# Altium project Dawn.PrjPcb
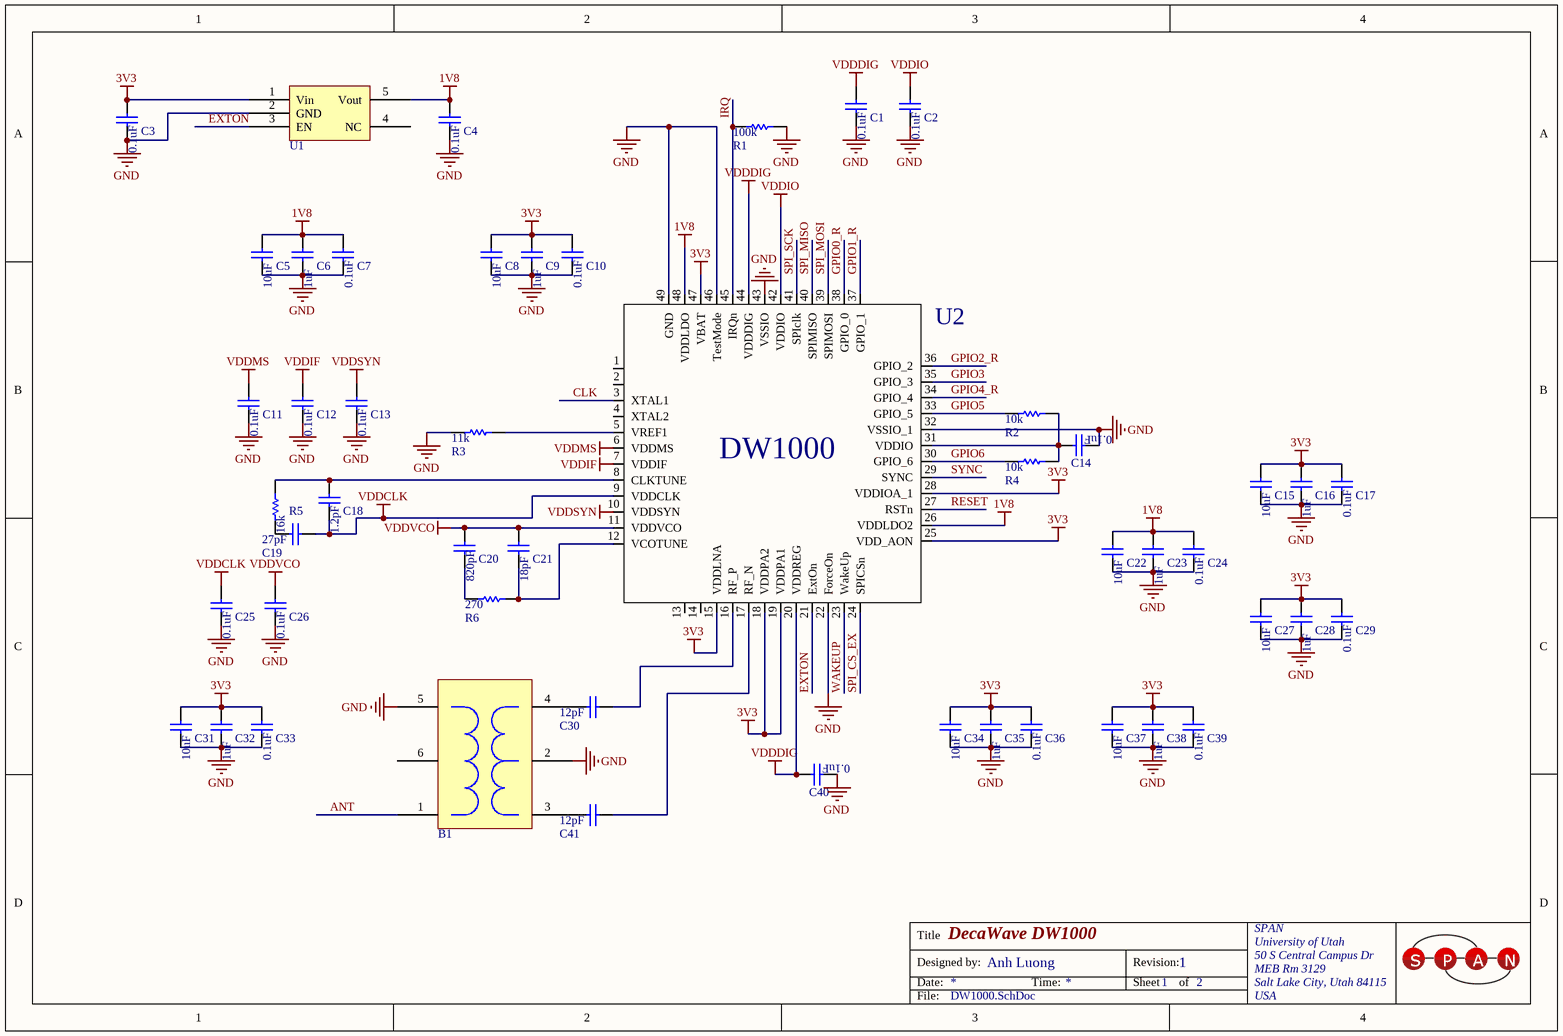
[diagram p0: DW1000.SchDoc]
3 sheets, 91 parts. Net scope: global (net labels, ports and power ports of the same name join across sheets).
Board file: Dawn.PcbDoc
Sheets:
  DW1000.SchDoc
  Dawn.SchDoc
  HFXO.SchDoc

## Sheet DW1000.SchDoc: DecaWave DW1000
size A4; CompanyName: SPAN; Engineer: Anh Luong; Organization: University of Utah; Address1: 50 S Central Campus Dr; Address2: MEB Rm 3129; Address3: Salt Lake City, Utah 84115; Address4: USA; Revision: 1; SheetNumber: 1; SheetTotal: 2

### Parts
B1  HHM1595A1  [BALUN]  (value not drawn)
C1  GRM188R71C104KA01D  [CAPC1608X08N (0603)]  (value not drawn)
C2  GRM188R71C104KA01D  [CAPC1608X08N (0603)]  (value not drawn)
C3  GRM188R71C104KA01D  [CAPC1608X08N (0603)]  (value not drawn)
C4  GRM188R71C104KA01D  [CAPC1608X08N (0603)]  (value not drawn)
C5  GRM188R60J106ME47D  [CAPC1608X08N (0603)]  (value not drawn)
C6  GRM188R61A105KA61D  [CAPC1608X08N (0603)]  (value not drawn)
C7  GRM188R71C104KA01D  [CAPC1608X08N (0603)]  (value not drawn)
C8  GRM188R60J106ME47D  [CAPC1608X08N (0603)]  (value not drawn)
C9  GRM188R61A105KA61D  [CAPC1608X08N (0603)]  (value not drawn)
C10  GRM188R71C104KA01D  [CAPC1608X08N (0603)]  (value not drawn)
C11  GRM188R71C104KA01D  [CAPC1608X08N (0603)]  (value not drawn)
C12  GRM188R71C104KA01D  [CAPC1608X08N (0603)]  (value not drawn)
C13  GRM188R71C104KA01D  [CAPC1608X08N (0603)]  (value not drawn)
C14  GRM188R71C104KA01D  [CAPC1608X08N (0603)]  (value not drawn)
C15  GRM188R60J106ME47D  [CAPC1608X08N (0603)]  (value not drawn)
C16  GRM188R61A105KA61D  [CAPC1608X08N (0603)]  (value not drawn)
C17  GRM188R71C104KA01D  [CAPC1608X08N (0603)]  (value not drawn)
C18  GRM1885C1H1R2CA01D  [CAPC1608X08N (0603)]  (value not drawn)
C19  GRM1885C1H270JA01D  [CAPC1608X08N (0603)]  (value not drawn)
C20  GRM188R71H821KA01D  [CAPC1608X08N (0603)]  (value not drawn)
C21  GRM1885C1H180JA01D  [CAPC1608X08N (0603)]  (value not drawn)
C22  GRM188R60J106ME47D  [CAPC1608X08N (0603)]  (value not drawn)
C23  GRM188R61A105KA61D  [CAPC1608X08N (0603)]  (value not drawn)
C24  GRM188R71C104KA01D  [CAPC1608X08N (0603)]  (value not drawn)
C25  GRM188R71C104KA01D  [CAPC1608X08N (0603)]  (value not drawn)
C26  GRM188R71C104KA01D  [CAPC1608X08N (0603)]  (value not drawn)
C27  GRM188R60J106ME47D  [CAPC1608X08N (0603)]  (value not drawn)
C28  GRM188R61A105KA61D  [CAPC1608X08N (0603)]  (value not drawn)
C29  GRM188R71C104KA01D  [CAPC1608X08N (0603)]  (value not drawn)
C30  GRM1885C1H120JA01D  [CAPC1608X08N (0603)]  (value not drawn)
C31  GRM188R60J106ME47D  [CAPC1608X08N (0603)]  (value not drawn)
C32  GRM188R61A105KA61D  [CAPC1608X08N (0603)]  (value not drawn)
C33  GRM188R71C104KA01D  [CAPC1608X08N (0603)]  (value not drawn)
C34  GRM188R60J106ME47D  [CAPC1608X08N (0603)]  (value not drawn)
C35  GRM188R61A105KA61D  [CAPC1608X08N (0603)]  (value not drawn)
C36  GRM188R71C104KA01D  [CAPC1608X08N (0603)]  (value not drawn)
C37  GRM188R60J106ME47D  [CAPC1608X08N (0603)]  (value not drawn)
C38  GRM188R61A105KA61D  [CAPC1608X08N (0603)]  (value not drawn)
C39  GRM188R71C104KA01D  [CAPC1608X08N (0603)]  (value not drawn)
C40  GRM188R71C104KA01D  [CAPC1608X08N (0603)]  (value not drawn)
C41  GRM1885C1H120JA01D  [CAPC1608X08N (0603)]  (value not drawn)
R1  MCR03ERTJ104  [RESC1608X06N (0603)]  (value not drawn)
R2  MCR03ERTJ103  [RESC1608X06N (0603)]  (value not drawn)
R3  MCR03ERTJ113  [RESC1608X06N (0603)]  (value not drawn)
R4  MCR03ERTJ103  [RESC1608X06N (0603)]  (value not drawn)
R5  MCR03ERTJ163  [RESC1608X06N (0603)]  (value not drawn)
R6  MCR03ERTJ271  [RESC1608X06N (0603)]  (value not drawn)
U1  LP5907MFX-1.8/NOPB  [SOT95P280X145-5N]  (value not drawn)
U2  DW1000 IC  [QFN-48]  (value not drawn)

### Nets
1V8: C4.2 C5.2 C6.2 C7.2 C22.2 C23.2 C24.2 U1.5(Vout) U2.26(VDDLDO2) U2.48(VDDLDO)
3V3: C3.2 C8.2 C9.2 C10.2 C15.2 C16.2 C17.2 C27.2 C28.2 C29.2 C31.2 C32.2 C33.2 C34.2 C35.2 C36.2 C37.2 C38.2 C39.2 U1.1(Vin) U2.15(VDDLNA) U2.18(VDDPA2) U2.19(VDDPA1) U2.25(VDD_AON) U2.28(VDDIOA_1) U2.47(VBAT)
GND: B1.2 B1.5 C1.1 C2.1 C3.1 C4.1 C5.1 C6.1 C7.1 C8.1 C9.1 C10.1 C11.1 C12.1 C13.1 C14.1 C15.1 C16.1 C17.1 C22.1 C23.1 C24.1 C25.1 C26.1 C27.1 C28.1 C29.1 C31.1 C32.1 C33.1 C34.1 C35.1 C36.1 C37.1 C38.1 C39.1 C40.1 R1.2 R3.1 U1.2(GND) U2.22(ForceOn) U2.32(VSSIO_1) U2.43(VSSIO) U2.46(TestMode) U2.49(GND)
VDDCLK: C18.1 C19.2 C25.2 U2.9(VDDCLK)
VDDDIG: C1.2 C40.2 U2.20(VDDREG) U2.44(VDDDIG)
VDDIF: C12.2 U2.7(VDDIF)
VDDIO: C2.2 U2.42(VDDIO)
VDDMS: C11.2 U2.6(VDDMS)
VDDSYN: C13.2 U2.10(VDDSYN)
VDDVCO: C20.2 C21.2 C26.2 U2.11(VDDVCO)
ANT: B1.1
CLK: U2.3(XTAL1)
EXTON: U1.3(EN) U2.21(ExtOn)
GPIO0_R: U2.38(GPIO_0)
GPIO1_R: U2.37(GPIO_1)
GPIO2_R: U2.36(GPIO_2)
GPIO3: U2.35(GPIO_3)
GPIO4_R: U2.34(GPIO_4)
GPIO5: R2.1 U2.33(GPIO_5)
GPIO6: R4.1 U2.30(GPIO_6)
IRQ: R1.1 U2.45(IRQn)
RESET: U2.27(RSTn)
SPI_CS_EX: U2.24(SPICSn)
SPI_MISO: U2.40(SPIMISO)
SPI_MOSI: U2.39(SPIMOSI)  [project net SDI]
SPI_SCK: U2.41(SPIclk)  [project net SCLK]
SYNC: U2.29(SYNC)
WAKEUP: U2.23(WakeUp)
NetB1_3: B1.3 C41.1
NetB1_4: B1.4 C30.1
NetC14_2: C14.2 R2.2 R4.2 U2.31(VDDIO)
NetC18_2: C18.2 R5.2 U2.8(CLKTUNE)
NetC19_1: C19.1 R5.1
NetC20_1: C20.1 R6.1
NetC21_1: C21.1 R6.2 U2.12(VCOTUNE)
NetC30_2: C30.2 U2.16(RF_P)
NetC41_2: C41.2 U2.17(RF_N)
NetR3_2: R3.2 U2.5(VREF1)

Not connected (* = marked no-connect by the designer): B1 6; U1 4(NC); U2 1 2 4(XTAL2) 13 14

### Notes on the sheet
- Title
- Designed by:
- Date:
- Time:
- Revision:
- Sheet
- of
- File:
- (in symbol DW1000_QFN_48) DW1000
- (in symbol GRM188R60J106ME47D) 10uF
- (in symbol GRM188R61A105KA61D) 1uF
- (in symbol GRM188R71C104KA01D) 0.1uF

### Library data of the parts
B1 = HHM1595A1: XFMR BALUN RF 3.0-8.0GHZ UWB SMD; Manufacturer: TDK Corporation; Frequency Range: 3GHz ~ 8GHz; Impedance - Unbalanced/Balanced: 50 / 100 Ohm; Phase Difference: 180° ±20; Insertion Loss (Max): 1.5dB; Return Loss (Min): 8dB; Supplier 1: Digi-Key; Manufacturer Part Number: HHM1595A1; RoHS: RoHS Compliant; Category: RF/IF and RFID; Stock 1: 20610; Pricing 1: 1=1.38, 10=1.348, 100=0.7356, 250=0.66, 500=0.64626, 1000=0.4675 (USD); Packaging: Cut Tape (CT); Part Status: Active; Package / Case: 0805 (2012 Metric); Mounting Type: Surface Mount; ComponentLink1URL: https://product.tdk.com/info/en/documents/data_sheet/rf_balun_hhm1595a1_en.pdf; ComponentLink1Description: https://product.tdk.com/info/en/documents/data_sheet/rf_balun_hhm1595a1_en.pdf; Supplier Part Number 1: 445-3387-1-ND
C1-C4 C7 C10-C14 C17 C24-C26 C29 C33 C36 C39 C40 = GRM188R71C104KA01D: CAP CER 0.1UF 16V 10% X7R 0603; Manufacturer: Murata Electronics North America; Capacitance: 0.1µF; Supplier 1: Digi-Key; Manufacturer Part Number: GRM188R71C104KA01D; RoHS: RoHS Compliant; Category: Capacitors; Stock 1: 1458181; Pricing 1: 1=0.1, 10=0.019, 50=0.0102, 100=0.0086, 250=0.00704, 500=0.006, 1000=0.00468 (USD); Packaging: Cut Tape (CT); Tolerance: ±10%; Voltage - Rated: 16V; Temperature Coefficient: X7R; Mounting Type: Surface Mount, MLCC; Operating Temperature: -55°C ~ 125°C; Applications: General Purpose; Ratings: -; Package / Case: 0603 (1608 Metric); Size / Dimension: 0.063" L x 0.031" W (1.60mm x 0.80mm); Height - Seated (Max): -; Thickness (Max): 0.035" (0.90mm); Lead Spacing: -; Features: -; Lead Style: -; ComponentLink1URL: http://search.murata.co.jp/Ceramy/image/img/A01X/G101/ENG/GRM188R71C104KA01-01.pdf; ComponentLink1Description: http://search.murata.co.jp/Ceramy/image/img/A01X/G101/ENG/GRM188R71C104KA01-01.pdf
C5 C8 C15 C22 C27 C31 C34 C37 = GRM188R60J106ME47D: CAP CER 10UF 6.3V 20% X5R 0603; Manufacturer: Murata Electronics North America; Capacitance: 10µF; Supplier 1: Digi-Key; Manufacturer Part Number: GRM188R60J106ME47D; RoHS: RoHS Compliant; Category: Capacitors; Stock 1: 2128324; Pricing 1: 1=0.24, 10=0.2, 50=0.1126, 100=0.1, 250=0.075, 500=0.06626, 1000=0.05875 (USD); Packaging: Digi-Reel®; Voltage - Rated: 6.3V; Tolerance: ±20%; Temperature Coefficient: X5R; Mounting Type: Surface Mount, MLCC; Operating Temperature: -55°C ~ 85°C; Applications: General Purpose; Ratings: -; Package / Case: 0603 (1608 Metric); Size / Dimension: 0.063" L x 0.031" W (1.60mm x 0.80mm); Height - Seated (Max): -; Thickness (Max): 0.035" (0.90mm); Lead Spacing: -; Features: -; Lead Style: -; ComponentLink1URL: http://search.murata.co.jp/Ceramy/image/img/A01X/G101/ENG/GRM188R60J106ME47-01.pdf; ComponentLink1Description: http://search.murata.co.jp/Ceramy/image/img/A01X/G101/ENG/GRM188R60J106ME47-01.pdf; Supplier 2: Digi-Key
C6 C9 C16 C23 C28 C32 C35 C38 = GRM188R61A105KA61D: CAP CER 1UF 10V 10% X5R 0603; Manufacturer: Murata Electronics North America; Capacitance: 1.0µF; Supplier 1: Digi-Key; Manufacturer Part Number: GRM188R61A105KA61D; RoHS: RoHS Compliant; Category: Capacitors; Stock 1: 244919; Pricing 1: 1=0.1, 10=0.041, 50=0.0224, 100=0.019, 250=0.01552, 500=0.01328, 1000=0.01035 (USD); Packaging: Cut Tape (CT); Voltage - Rated: 10V; Tolerance: ±10%; Temperature Coefficient: X5R; Mounting Type: Surface Mount, MLCC; Operating Temperature: -55°C ~ 85°C; Applications: General Purpose; Ratings: -; Package / Case: 0603 (1608 Metric); Size / Dimension: 0.063" L x 0.031" W (1.60mm x 0.80mm); Height - Seated (Max): -; Thickness (Max): 0.035" (0.90mm); Lead Spacing: -; Features: -; Lead Style: -; ComponentLink1URL: http://search.murata.co.jp/Ceramy/image/img/A01X/G101/ENG/GRM188R61A105KA61-01.pdf; ComponentLink1Description: http://search.murata.co.jp/Ceramy/image/img/A01X/G101/ENG/GRM188R61A105KA61-01.pdf
C18 = GRM1885C1H1R2CA01D: CAP CER 1.2PF 50V NP0 0603; Manufacturer: Murata Electronics North America; Tolerance: ±0.25pF; Temperature Coefficient: C0G, NP0; Supplier 1: Digi-Key; Manufacturer Part Number: GRM1885C1H1R2CA01D; RoHS: RoHS Compliant; Category: Capacitors; Stock 1: 36680; Pricing 1: 1=0.1, 10=0.053, 50=0.0286, 100=0.0242, 250=0.0198, 500=0.01694, 1000=0.0132 (USD); Packaging: Cut Tape (CT); Part Status: Active; Capacitance: 1.2pF; Voltage - Rated: 50V; Operating Temperature: -55°C ~ 125°C; Features: -; Ratings: -; Applications: General Purpose; Failure Rate: *; Mounting Type: Surface Mount, MLCC; Package / Case: 0603 (1608 Metric); Size / Dimension: 0.063" L x 0.031" W (1.60mm x 0.80mm); Height - Seated (Max): -; Thickness (Max): 0.035" (0.90mm); Lead Spacing: -; Lead Style: -; ComponentLink1URL: http://www.murata.com/~/media/webrenewal/support/library/catalog/products/capacitor/mlcc/c02e.pdf; ComponentLink1Description: http://www.murata.com/~/media/webrenewal/support/library/catalog/products/capacitor/mlcc/c02e.pdf; Supplier Part Number 1: 490-10709-1-ND
C19 = GRM1885C1H270JA01D: CAP CER 27PF 50V NP0 0603; Manufacturer: Murata Electronics North America; Tolerance: ±5%; Temperature Coefficient: C0G, NP0; Supplier 1: Digi-Key; Manufacturer Part Number: GRM1885C1H270JA01D; RoHS: RoHS Compliant; Category: Capacitors; Stock 1: 113117; Pricing 1: 1=0.1, 10=0.041, 50=0.0222, 100=0.0187, 250=0.01532, 500=0.0131, 1000=0.0102 (USD); Packaging: Cut Tape (CT); Part Status: Active; Capacitance: 27pF; Voltage - Rated: 50V; Operating Temperature: -55°C ~ 125°C; Features: -; Ratings: -; Applications: General Purpose; Failure Rate: *; Mounting Type: Surface Mount, MLCC; Package / Case: 0603 (1608 Metric); Size / Dimension: 0.063" L x 0.031" W (1.60mm x 0.80mm); Height - Seated (Max): -; Thickness (Max): 0.035" (0.90mm); Lead Spacing: -; Lead Style: -; ComponentLink1URL: http://www.murata.com/~/media/webrenewal/support/library/catalog/products/capacitor/mlcc/c02e.pdf; ComponentLink1Description: http://www.murata.com/~/media/webrenewal/support/library/catalog/products/capacitor/mlcc/c02e.pdf; Supplier Part Number 1: 490-1413-1-ND
C20 = GRM188R71H821KA01D: CAP CER 820PF 50V X7R 0603; Manufacturer: Murata Electronics North America; Tolerance: ±10%; Supplier 1: Digi-Key; Manufacturer Part Number: GRM188R71H821KA01D; RoHS: RoHS Compliant; Category: Capacitors; Stock 1: 61936; Pricing 1: 1=0.1, 10=0.067, 25=0.0476, 50=0.0364, 100=0.0308, 250=0.0252, 500=0.02156, 1000=0.0168 (USD); Packaging: Cut Tape (CT); Part Status: Active; Capacitance: 820pF; Voltage - Rated: 50V; Temperature Coefficient: X7R; Operating Temperature: -55°C ~ 125°C; Features: -; Ratings: -; Applications: General Purpose; Failure Rate: *; Mounting Type: Surface Mount, MLCC; Package / Case: 0603 (1608 Metric); Size / Dimension: 0.063" L x 0.031" W (1.60mm x 0.80mm); Height - Seated (Max): -; Thickness (Max): 0.035" (0.90mm); Lead Spacing: -; Lead Style: -; ComponentLink1URL: http://www.murata.com/~/media/webrenewal/support/library/catalog/products/capacitor/mlcc/c02e.pdf; ComponentLink1Description: http://www.murata.com/~/media/webrenewal/support/library/catalog/products/capacitor/mlcc/c02e.pdf; Supplier Part Number 1: 490-1493-1-ND
C21 = GRM1885C1H180JA01D: CAP CER 18PF 50V NP0 0603; Manufacturer: Murata Electronics North America; Tolerance: ±5%; Temperature Coefficient: C0G, NP0; Supplier 1: Digi-Key; Manufacturer Part Number: GRM1885C1H180JA01D; RoHS: RoHS Compliant; Category: Capacitors; Stock 1: 281577; Pricing 1: 1=0.1, 10=0.041, 50=0.0222, 100=0.0187, 250=0.01532, 500=0.0131, 1000=0.0102 (USD); Packaging: Cut Tape (CT); Part Status: Active; Capacitance: 18pF; Voltage - Rated: 50V; Operating Temperature: -55°C ~ 125°C; Features: -; Ratings: -; Applications: General Purpose; Failure Rate: *; Mounting Type: Surface Mount, MLCC; Package / Case: 0603 (1608 Metric); Size / Dimension: 0.063" L x 0.031" W (1.60mm x 0.80mm); Height - Seated (Max): -; Thickness (Max): 0.035" (0.90mm); Lead Spacing: -; Lead Style: -; ComponentLink1URL: http://www.murata.com/~/media/webrenewal/support/library/catalog/products/capacitor/mlcc/c02e.pdf; ComponentLink1Description: http://www.murata.com/~/media/webrenewal/support/library/catalog/products/capacitor/mlcc/c02e.pdf; Supplier Part Number 1: 490-1409-1-ND
C30 C41 = GRM1885C1H120JA01D: CAP CER 12PF 50V NP0 0603; Manufacturer: Murata Electronics North America; Tolerance: ±5%; Temperature Coefficient: C0G, NP0; Supplier 1: Digi-Key; Manufacturer Part Number: GRM1885C1H120JA01D; RoHS: RoHS Compliant; Category: Capacitors; Stock 1: 151484; Pricing 1: 1=0.1, 10=0.041, 50=0.0222, 100=0.0187, 250=0.01532, 500=0.0131, 1000=0.0102 (USD); Packaging: Cut Tape (CT); Part Status: Active; Capacitance: 12pF; Voltage - Rated: 50V; Operating Temperature: -55°C ~ 125°C; Features: -; Ratings: -; Applications: General Purpose; Failure Rate: *; Mounting Type: Surface Mount, MLCC; Package / Case: 0603 (1608 Metric); Size / Dimension: 0.063" L x 0.031" W (1.60mm x 0.80mm); Height - Seated (Max): -; Thickness (Max): 0.035" (0.90mm); Lead Spacing: -; Lead Style: -; ComponentLink1URL: http://www.murata.com/~/media/webrenewal/support/library/catalog/products/capacitor/mlcc/c02e.pdf; ComponentLink1Description: http://www.murata.com/~/media/webrenewal/support/library/catalog/products/capacitor/mlcc/c02e.pdf; Supplier Part Number 1: 490-1405-1-ND
R1 = MCR03ERTJ104: RES SMD 100K OHM 5% 1/10W 0603; Manufacturer: Rohm Semiconductor; Power (Watts): 0.1W, 1/10W; Temperature Coefficient: ±200ppm/°C; Supplier 1: Digi-Key; Manufacturer Part Number: MCR03ERTJ104; RoHS: RoHS Compliant; Category: Resistors; Stock 1: 136580; Pricing 1: 1=0.1, 10=0.019, 25=0.0132, 100=0.0075, 250=0.00576, 500=0.0046, 1000=0.00338 (USD); Packaging: Cut Tape (CT); Part Status: Active; Resistance (Ohms): 100k; Tolerance: ±5%; Composition: Thick Film; Features: -; Operating Temperature: -55°C ~ 155°C; Package / Case: 0603 (1608 Metric); Supplier Device Package: 0603; Size / Dimension: 0.063" L x 0.031" W (1.60mm x 0.80mm); Height: 0.022" (0.55mm); Number of Terminations: 2; Failure Rate: -; ComponentLink1URL: http://rohmfs.rohm.com/en/products/databook/datasheet/passive/resistor/chip_resistor/mcr_g.pdf; ComponentLink1Description: http://rohmfs.rohm.com/en/products/databook/datasheet/passive/resistor/chip_resistor/mcr_g.pdf; Supplier Part Number 1: RHM100KCGCT-ND
R2 R4 = MCR03ERTJ103: RES 10K OHM 1/10W 5% 0603 SMD; Manufacturer: Rohm Semiconductor; Power (Watts): 0.1W, 1/10W; Temperature Coefficient: ±200ppm/°C; Supplier 1: Digi-Key; Manufacturer Part Number: MCR03ERTJ103; RoHS: RoHS Compliant; Category: Resistors; Stock 1: 330000; Pricing 1: 5000=0.00103, 10000=0.00089, 25000=0.00078, 50000=0.00072, 125000=0.0007 (USD); Packaging: Tape & Reel (TR); Resistance (Ohms): 10k; Tolerance: ±5%; Composition: Thick Film; Features: -; Package / Case: 0603 (1608 Metric); Supplier Device Package: 0603 (1608 Metric); Size / Dimension: 0.063" L x 0.031" W (1.60mm x 0.80mm); Height: 0.022" (0.55mm); Number of Terminations: 2; ComponentLink1URL: http://rohmfs.rohm.com/en/products/databook/datasheet/passive/resistor/chip_resistor/mcr_g.pdf; ComponentLink1Description: http://rohmfs.rohm.com/en/products/databook/datasheet/passive/resistor/chip_resistor/mcr_g.pdf
R3 = MCR03ERTJ113: RES SMD 11K OHM 5% 1/10W 0603; Manufacturer: Rohm Semiconductor; Power (Watts): 0.1W, 1/10W; Temperature Coefficient: ±200ppm/°C; Supplier 1: Digi-Key; Manufacturer Part Number: MCR03ERTJ113; RoHS: RoHS Compliant; Category: Resistors; Stock 1: 8319; Pricing 1: 1=0.1, 10=0.019, 25=0.0132, 100=0.0075, 250=0.00576, 500=0.0046, 1000=0.00338 (USD); Packaging: Cut Tape (CT); Part Status: Active; Resistance (Ohms): 11k; Tolerance: ±5%; Composition: Thick Film; Features: -; Operating Temperature: -55°C ~ 155°C; Package / Case: 0603 (1608 Metric); Supplier Device Package: 0603; Size / Dimension: 0.063" L x 0.031" W (1.60mm x 0.80mm); Height: 0.022" (0.55mm); Number of Terminations: 2; Failure Rate: -; ComponentLink1URL: http://rohmfs.rohm.com/en/products/databook/datasheet/passive/resistor/chip_resistor/mcr_g.pdf; ComponentLink1Description: http://rohmfs.rohm.com/en/products/databook/datasheet/passive/resistor/chip_resistor/mcr_g.pdf; Supplier Part Number 1: RHM11KCGCT-ND
R5 = MCR03ERTJ163: RES SMD 16K OHM 5% 1/10W 0603; Manufacturer: Rohm Semiconductor; Power (Watts): 0.1W, 1/10W; Temperature Coefficient: ±200ppm/°C; Supplier 1: Digi-Key; Manufacturer Part Number: MCR03ERTJ163; RoHS: RoHS Compliant; Category: Resistors; Stock 1: 7457; Pricing 1: 1=0.1, 10=0.019, 25=0.0132, 100=0.0075, 250=0.00576, 500=0.0046, 1000=0.00338 (USD); Packaging: Cut Tape (CT); Part Status: Active; Resistance (Ohms): 16k; Tolerance: ±5%; Composition: Thick Film; Features: -; Operating Temperature: -55°C ~ 155°C; Package / Case: 0603 (1608 Metric); Supplier Device Package: 0603; Size / Dimension: 0.063" L x 0.031" W (1.60mm x 0.80mm); Height: 0.022" (0.55mm); Number of Terminations: 2; Failure Rate: -; ComponentLink1URL: http://rohmfs.rohm.com/en/products/databook/datasheet/passive/resistor/chip_resistor/mcr_g.pdf; ComponentLink1Description: http://rohmfs.rohm.com/en/products/databook/datasheet/passive/resistor/chip_resistor/mcr_g.pdf; Supplier Part Number 1: RHM16KCGCT-ND
R6 = MCR03ERTJ271: RES SMD 270 OHM 5% 1/10W 0603; Manufacturer: Rohm Semiconductor; Resistance (Ohms): 270; Power (Watts): 0.1W, 1/10W; Temperature Coefficient: ±200ppm/°C; Supplier 1: Digi-Key; Manufacturer Part Number: MCR03ERTJ271; RoHS: RoHS Compliant; Category: Resistors; Stock 1: 34918; Pricing 1: 1=0.1, 10=0.019, 25=0.0132, 100=0.0075, 250=0.00576, 500=0.0046, 1000=0.00338 (USD); Packaging: Cut Tape (CT); Part Status: Active; Tolerance: ±5%; Composition: Thick Film; Features: -; Operating Temperature: -55°C ~ 155°C; Package / Case: 0603 (1608 Metric); Supplier Device Package: 0603; Size / Dimension: 0.063" L x 0.031" W (1.60mm x 0.80mm); Height: 0.022" (0.55mm); Number of Terminations: 2; Failure Rate: -; ComponentLink1URL: http://rohmfs.rohm.com/en/products/databook/datasheet/passive/resistor/chip_resistor/mcr_g.pdf; ComponentLink1Description: http://rohmfs.rohm.com/en/products/databook/datasheet/passive/resistor/chip_resistor/mcr_g.pdf; Supplier Part Number 1: RHM270CGCT-ND
U1 = LP5907MFX-1.8/NOPB: IC REG LDO 1.8V 0.25A SOT23-5; Manufacturer: Texas Instruments; Regulator Topology: Positive Fixed; Current - Output: 250mA; Number of Regulators: 1; Voltage - Input: 2.2 V ~ 5.5 V; Supplier 1: Digi-Key; Manufacturer Part Number: LP5907MFX-1.8/NOPB; RoHS: RoHS Compliant; Category: Integrated Circuits (ICs); Stock 1: 13246; Pricing 1: 1=0.57, 10=0.488, 100=0.3641, 500=0.28602, 1000=0.1575 (USD); Packaging: Cut Tape (CT); Part Status: Active; Voltage - Output: 1.8V; Voltage - Dropout (Typical): -; Current - Limit (Min): -; Operating Temperature: -40°C ~ 125°C; Mounting Type: Surface Mount; Package / Case: SC-74A, SOT-753; Supplier Device Package: SOT-23; ComponentLink1URL: http://www.ti.com/lit/ds/symlink/lp5907.pdf; ComponentLink1Description: http://www.ti.com/lit/ds/symlink/lp5907.pdf; Supplier Part Number 1: 296-41463-1-ND
U2 = DW1000_QFN_48: UWB DW1000; Manufacturer: Decawave Ltd.; Part Number: DW1000_QFN; Component Code: n/a; Component Type: Standard; Cost: *; Footprint: QFN_48; ComponentLink1Description: Datasheet Link

## Sheet Dawn.SchDoc: DecaWave DW1000
size A4; CompanyName: SPAN; Engineer: Anh Luong; Organization: University of Utah; Address1: 50 S Central Campus Dr; Address2: MEB Rm 3129; Address3: Salt Lake City, Utah 84115; Address4: USA; Revision: 1; SheetNumber: 2; SheetTotal: 2
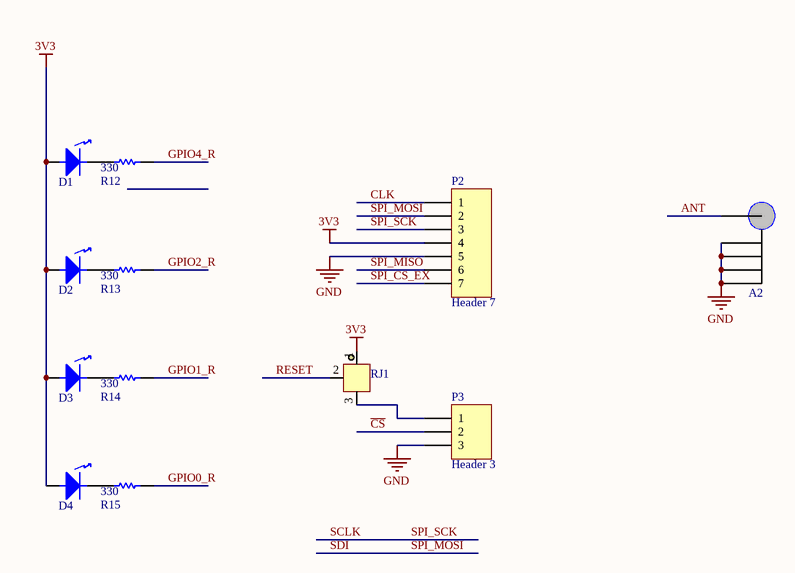
[diagram p1: Dawn.SchDoc]

### Parts
A2  CONSMA003.062  [SMA_EDGE_MNT]  (value not drawn)
D1  LG Q971-KN-1  [CHIPLED0603]  (value not drawn)
D2  LG Q971-KN-1  [CHIPLED0603]  (value not drawn)
D3  LG Q971-KN-1  [CHIPLED0603]  (value not drawn)
D4  LG Q971-KN-1  [CHIPLED0603]  (value not drawn)
P2  Header 7  [HDR1X7]
P3  Header 3  [HDR1X3]
R12  MCR03ERTJ331  [RESC1608X06N (0603)]  (value not drawn)
R13  MCR03ERTJ331  [RESC1608X06N (0603)]  (value not drawn)
R14  MCR03ERTJ331  [RESC1608X06N (0603)]  (value not drawn)
R15  MCR03ERTJ331  [RESC1608X06N (0603)]  (value not drawn)
RJ1  R_J  [RJ]  (value not drawn)

### Nets
3V3: D1.1 D2.1 D3.1 D4.1 P2.4 RJ1.1
GND: A2.2 A2.3 A2.4 A2.5 P2.5 P3.3
ANT: A2.1
~{CS}: P3.2
CLK: P2.1
GPIO0_R: R15.2
GPIO1_R: R14.2
GPIO2_R: R13.2
GPIO4_R: R12.2
RESET: RJ1.2
SCLK: P2.3  [also labelled SPI_SCK]
SDI: P2.2  [also labelled SPI_MOSI]
SPI_CS_EX: P2.7
SPI_MISO: P2.6
NetD1_2: D1.2 R12.1
NetD2_2: D2.2 R13.1
NetD3_2: D3.2 R14.1
NetD4_2: D4.2 R15.1
NetP3_1: P3.1 RJ1.3

### Notes on the sheet
- Title
- Designed by:
- Date:
- Time:
- Revision:
- Sheet
- of
- File:

### Library data of the parts
A2 = CONSMA003.062: CONN SMA JACK 50 OHM EDGE MNT; Manufacturer: Linx Technologies Inc; Connector Type: Jack, Female Socket; Contact Termination: Solder; Impedance: 50 Ohm; Body Material: Brass; Body Finish: Nickel; Center Contact Material: Beryllium Copper; Center Contact Plating: Gold; Dielectric Material: Polytetrafluoroethylene (PTFE); Supplier 1: Digi-Key; Manufacturer Part Number: CONSMA003.062; RoHS: RoHS Compliant; Category: Connectors, Interconnects; Stock 1: 6857; Pricing 1: 1=3.37, 25=3.09, 100=2.81, 500=2.6125 (USD); Packaging: Bulk; Connector Style: SMA; Shield Termination: Solder; Mounting Type: Board Edge, End Launch; Cable Group: -; Fastening Type: Threaded; Frequency - Max: -; Features: -; Housing Color: Silver; Ingress Protection: -; Voltage Rating: -; Operating Temperature: -65°C ~ 165°C; ComponentLink1URL: http://www.linxtechnologies.com/resources/diagrams/consma003.062.pdf; ComponentLink1Description: http://www.linxtechnologies.com/resources/diagrams/consma003.062.pdf
D1-D4 = LG Q971-KN-1: LED CHIPLED 570NM GREEN 0603 SMD; Manufacturer: OSRAM Opto Semiconductors Inc; Wavelength - Peak: 572nm; Millicandela Rating: 10mcd; Voltage - Forward (Vf) Typ: 2.2V; Current - Test: 20mA; Viewing Angle: 160°; Lens Type: Diffused; Lens Style/Size: Rectangle with Flat Top, 1mm x 0.8mm; Supplier 1: Digi-Key; Manufacturer Part Number: LG Q971-KN-1; RoHS: RoHS Compliant; Category: Optoelectronics; Stock 1: 44000; Pricing 1: 4000=0.03632 (USD); Packaging: Tape & Reel (TR); Color: Green; Wavelength - Dominant: 570nm; Package / Case: 0603 (1608 Metric); Size / Dimension: 1.60mm L x 0.80mm W; Height: 0.80mm; Mounting Type: Surface Mount; Luminous Flux @ Current - Test: -; ComponentLink1URL: http://catalog.osram-os.com/catalogue/catalogue.do;jsessionid=DE4D071D0D2758CC117C711BF848053E?act=downloadFile&favOid=0200000600005069000100b6; ComponentLink1Description: http://catalog.osram-os.com/catalogue/catalogue.do;jsessionid=DE4D071D0D2758CC117C711BF848053E?act=downloadFile&favOid=0200000600005069000100b6
P2 = Header 7: Header, 7-Pin; LatestRevisionDate: 17-Jul-2002; LatestRevisionNote: Re-released for DXP Platform.; Publisher: Altium Limited
P3 = Header 3: Header, 3-Pin; LatestRevisionDate: 17-Jul-2002; LatestRevisionNote: Re-released for DXP Platform.; Publisher: Altium Limited
R12-R15 = MCR03ERTJ331: RES 330 OHM 1/10W 5% 0603 SMD; Manufacturer: Rohm Semiconductor; Resistance (Ohms): 330; Power (Watts): 0.1W, 1/10W; Temperature Coefficient: ±200ppm/°C; Supplier 1: Digi-Key; Manufacturer Part Number: MCR03ERTJ331; RoHS: RoHS Compliant; Category: Resistors; Stock 1: 12878; Pricing 1: 1=0.1, 10=0.013, 25=0.0092, 100=0.0052, 250=0.00396, 500=0.00316, 1000=0.00233 (USD); Packaging: Digi-Reel®; Tolerance: ±5%; Composition: Thick Film; Features: -; Package / Case: 0603 (1608 Metric); Supplier Device Package: 0603 (1608 Metric); Size / Dimension: 0.063" L x 0.031" W (1.60mm x 0.80mm); Height: 0.022" (0.55mm); Number of Terminations: 2; ComponentLink1URL: http://rohmfs.rohm.com/en/products/databook/datasheet/passive/resistor/chip_resistor/mcr_g.pdf; ComponentLink1Description: http://rohmfs.rohm.com/en/products/databook/datasheet/passive/resistor/chip_resistor/mcr_g.pdf
RJ1 = R_J: Resistor Jumper; Value: DNP; Mounting Type: Surface Mount, MLCC; Applications: General Purpose; Package / Case: 0603 (1608 Metric)

## Sheet HFXO.SchDoc: Chronos
size A4; CompanyName: RF Ranging Inc.; Engineer: Thomas Schmid; Revision: 4; SheetNumber: 7; SheetTotal: 10
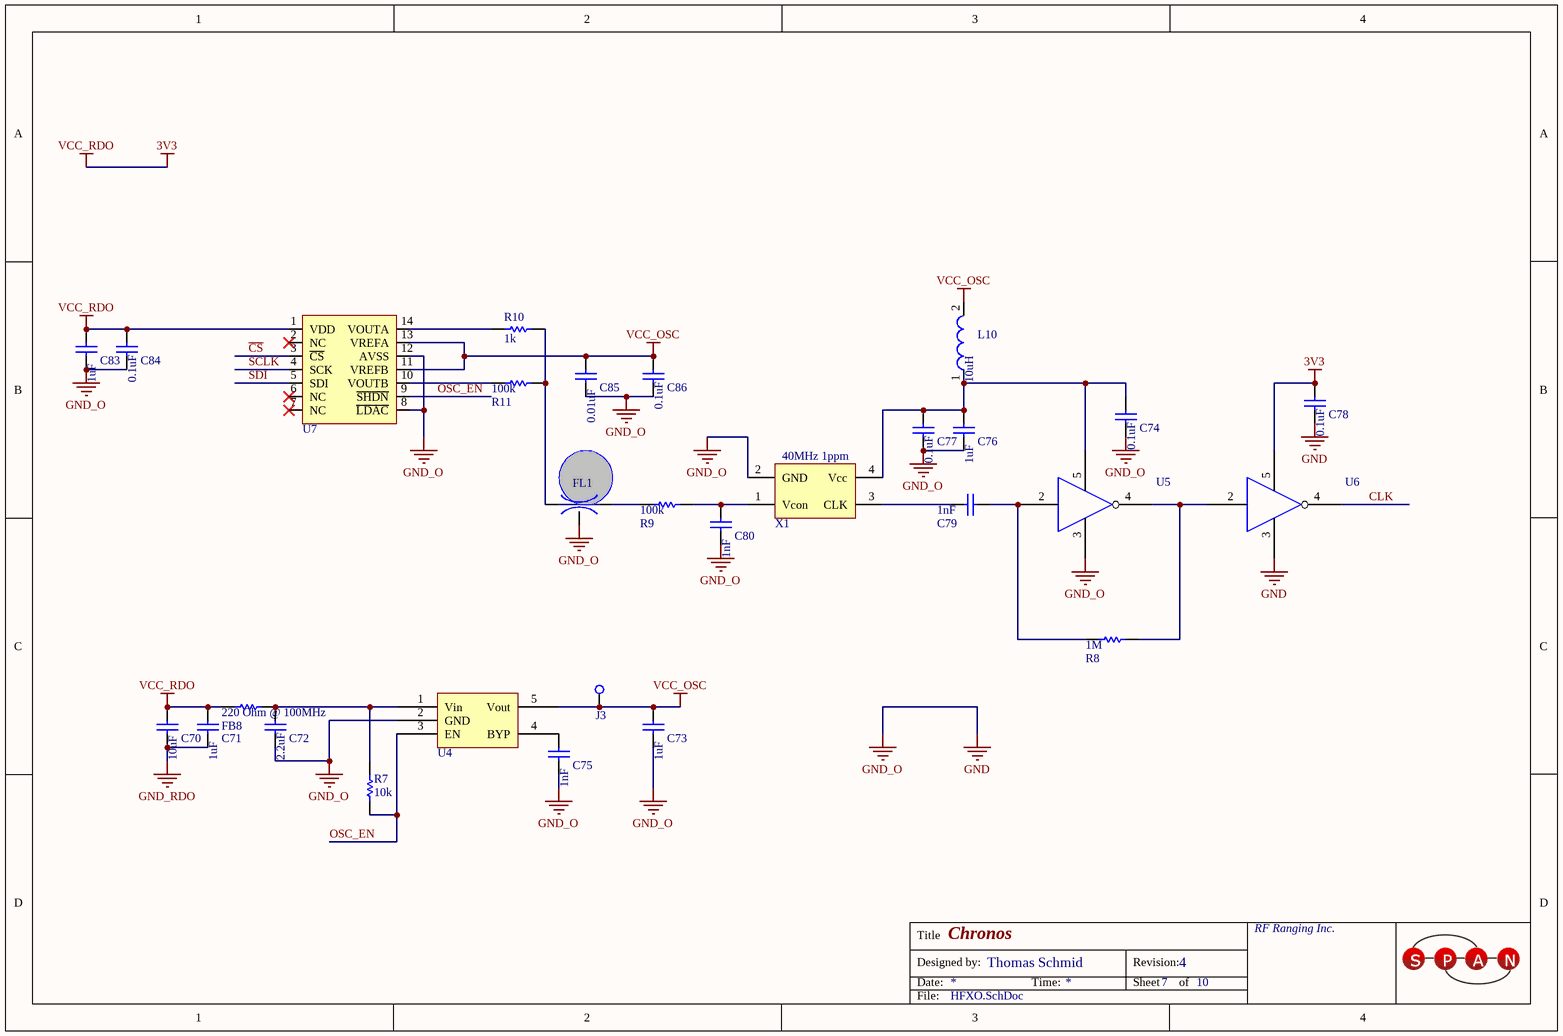
[diagram p2: HFXO.SchDoc]

### Parts
C70  GRM188C81C106MA73D  [CAPC1608X08N (0603)]  (value not drawn)
C71  GRM188R61A105KA61D  [CAPC1608X08N (0603)]  (value not drawn)
C72  GRM188R60J225KE19D  [CAPC1608X08N (0603)]  (value not drawn)
C73  GRM188R61A105KA61D  [CAPC1608X08N (0603)]  (value not drawn)
C74  GRM188R71C104KA01D  [CAPC1608X08N (0603)]  (value not drawn)
C75  GRM1885C1H102JA01D  [CAPC1608X08N (0603)]  (value not drawn)
C76  GRM188R61A105KA61D  [CAPC1608X08N (0603)]  (value not drawn)
C77  GRM188R71C104KA01D  [CAPC1608X08N (0603)]  (value not drawn)
C78  GRM188R71C104KA01D  [CAPC1608X08N (0603)]  (value not drawn)
C79  GRM1885C1H102JA01D  [CAPC1608X08N (0603)]  (value not drawn)
C80  GRM1885C1H102JA01D  [CAPC1608X08N (0603)]  (value not drawn)
C83  GRM188R61A105KA61D  [CAPC1608X08N (0603)]  (value not drawn)
C84  GRM188R71C104KA01D  [CAPC1608X08N (0603)]  (value not drawn)
C85  GRM188R71C103KA01D  [CAPC1608X08N (0603)]  (value not drawn)
C86  GRM188R71C104KA01D  [CAPC1608X08N (0603)]  (value not drawn)
FB8  BLM18BD221SN1D  [RESC1608X06N (0603)]  (value not drawn)
FL1  NFM21CC223R1H3D  [NFM21C]  (value not drawn)
J3  5004  [TP]  (value not drawn)
L10  LQM18FN100M00D  [INDC1608X08N]  (value not drawn)
R7  value 10k  [RESC1608X06N (0603)]  (hidden comment: MCR03ERTF1002)
R8  RC0603FR-071ML  [RESC1608X06N (0603)]  (value not drawn)
R9  RC0603FR-07100KL  [RESC1608X06N (0603)]  (value not drawn)
R10  value 1k  (hidden comment: CRCW06031K00FKEA)
R11  RC0603FR-07100KL  [RESC1608X06N (0603)]  (value not drawn)
U4  FAN2500S30X  [SOT95P280X145-5N]  (value not drawn)
U5  NC7SPU04P5X  [SC70]  (value not drawn)
U6  NC7SPU04P5X  [SC70]  (value not drawn)
U7  MCP4922-E/ST  [TSOP65P640X110-14N]  (value not drawn)
X1  ASVTX-12-A-40.000MHZ-H10-T  [2.5x2.0x0.9mmXTAL]  (value not drawn)

### Nets
3V3: C70.2 C71.2 C78.2 C83.2 C84.2 FB8.1 U6.5 U7.1(VDD)  [also labelled VCC_RDO]
GND: C72.1 C73.1 C74.1 C75.1 C76.1 C77.1 C78.1 C80.1 C83.1 C84.1 C85.1 C86.1 FL1.2 U4.2(GND) U5.3 U6.3 U7.8(~{LDAC}) U7.12(AVSS) X1.2(GND)  [also labelled GND_O]
GND_RDO: C70.1 C71.1
VCC_OSC: C73.2 C85.2 C86.2 J3.1 L10.2 U4.5(Vout) U7.11(VREFB) U7.13(VREFA)
~{CS}: U7.3(~{CS})
CLK: U6.4
OSC_EN: R7.1 U4.3(EN) U7.9(~{SHDN})
SCLK: U7.4(SCK)
SDI: U7.5(SDI)
NetC72_2: C72.2 FB8.2 R7.2 U4.1(Vin)
NetC74_2: C74.2 C76.2 C77.2 L10.1 U5.5 X1.4(Vcc)
NetC75_2: C75.2 U4.4(BYP)
NetC79_1: C79.1 X1.3(CLK)
NetC79_2: C79.2 R8.1 U5.2
NetC80_2: C80.2 R9.2 X1.1(Vcon)
NetFL1_1: FL1.1 R10.2 R11.2
NetFL1_3: FL1.3 R9.1
NetR8_2: R8.2 U5.4 U6.2
NetR10_1: R10.1 U7.14(VOUTA)
NetR11_1: R11.1 U7.10(VOUTB)

Not connected (* = marked no-connect by the designer): U5 1; U6 1; U7 2(NC)* 6(NC)* 7(NC)*

### Notes on the sheet
- Title
- Designed by:
- Date:
- Time:
- Revision:
- Sheet
- of
- File:
- (in symbol ASVTX-12-A-40.000MHZ-H10-T) 40MHz 1ppm
- (in symbol GRM188C81C106MA73D) 10uF
- (in symbol GRM188R60J225KE19D) 2.2uF
- (in symbol GRM188R61A105KA61D) 1uF
- (in symbol GRM188R71C103KA01D) 0.01uF
- (in symbol GRM188R71C104KA01D) 0.1uF
- (in symbol GRM1885C1H102JA01D) 1nF
- (in symbol LQM18FN100M00D) 10uH

### Library data of the parts
C70 = GRM188C81C106MA73D: CAP CER 10UF 16V 20% X6S 0603; Manufacturer: Murata Electronics North America; Capacitance: 10µF; Supplier 1: Digi-Key; Manufacturer Part Number: GRM188C81C106MA73D; RoHS: RoHS Compliant; Category: Capacitors; Stock 1: 59274; Pricing 1: 1=0.4, 10=0.349, 50=0.2118, 100=0.1744, 250=0.13952, 500=0.12708, 1000=0.11237 (USD); Packaging: Cut Tape (CT); Voltage - Rated: 16V; Tolerance: ±20%; Temperature Coefficient: X6S; Mounting Type: Surface Mount, MLCC; Operating Temperature: -55°C ~ 105°C; Applications: General Purpose; Ratings: -; Package / Case: 0603 (1608 Metric); Size / Dimension: 0.063" L x 0.031" W (1.60mm x 0.80mm); Height - Seated (Max): -; Thickness (Max): 0.031" (0.80mm); Lead Spacing: -; Features: -; Lead Style: -; ComponentLink1URL: http://www.murata.com/products/catalog/pdf/c02e.pdf; ComponentLink1Description: http://www.murata.com/products/catalog/pdf/c02e.pdf
C71 C73 C76 C83 = GRM188R61A105KA61D: as C6 on sheet DW1000; Supplier 1: Digi-Key; Manufacturer Part Number: GRM188R61A105KA61D; RoHS: RoHS Compliant; Category: Capacitors; Stock 1: 244919; Pricing 1: 1=0.1, 10=0.041, 50=0.0224, 100=0.019, 250=0.01552, 500=0.01328, 1000=0.01035 (USD); Packaging: Cut Tape (CT); Voltage - Rated: 10V; Tolerance: ±10%; Temperature Coefficient: X5R; Mounting Type: Surface Mount, MLCC; Operating Temperature: -55°C ~ 85°C; Applications: General Purpose; Ratings: -; Package / Case: 0603 (1608 Metric); Size / Dimension: 0.063" L x 0.031" W (1.60mm x 0.80mm); Height - Seated (Max): -; Thickness (Max): 0.035" (0.90mm); Lead Spacing: -; Features: -; Lead Style: -; ComponentLink1URL: http://search.murata.co.jp/Ceramy/image/img/A01X/G101/ENG/GRM188R61A105KA61-01.pdf; ComponentLink1Description: http://search.murata.co.jp/Ceramy/image/img/A01X/G101/ENG/GRM188R61A105KA61-01.pdf
C72 = GRM188R60J225KE19D: CAP CER 2.2UF 6.3V 10% X5R 0603; Manufacturer: Murata Electronics North America; Capacitance: 2.2µF; Supplier 1: Digi-Key; Manufacturer Part Number: GRM188R60J225KE19D; RoHS: RoHS Compliant; Category: Capacitors; Stock 1: 155330; Pricing 1: 1=0.17, 10=0.114, 50=0.0658, 100=0.0543, 250=0.04572, 500=0.0383, 1000=0.03143 (USD); Packaging: Cut Tape (CT); Voltage - Rated: 6.3V; Tolerance: ±10%; Temperature Coefficient: X5R; Mounting Type: Surface Mount, MLCC; Operating Temperature: -55°C ~ 85°C; Applications: General Purpose; Ratings: -; Package / Case: 0603 (1608 Metric); Size / Dimension: 0.063" L x 0.031" W (1.60mm x 0.80mm); Height - Seated (Max): -; Thickness (Max): 0.035" (0.90mm); Lead Spacing: -; Features: -; Lead Style: -; ComponentLink1URL: http://search.murata.co.jp/Ceramy/image/img/A01X/G101/ENG/GRM188R60J225KE19-01.pdf; ComponentLink1Description: http://search.murata.co.jp/Ceramy/image/img/A01X/G101/ENG/GRM188R60J225KE19-01.pdf
C74 C77 C78 C84 C86 = GRM188R71C104KA01D: as C1 on sheet DW1000; Supplier 1: Digi-Key; Manufacturer Part Number: GRM188R71C104KA01D; RoHS: RoHS Compliant; Category: Capacitors; Stock 1: 1458181; Pricing 1: 1=0.1, 10=0.019, 50=0.0102, 100=0.0086, 250=0.00704, 500=0.006, 1000=0.00468 (USD); Packaging: Cut Tape (CT); Tolerance: ±10%; Voltage - Rated: 16V; Temperature Coefficient: X7R; Mounting Type: Surface Mount, MLCC; Operating Temperature: -55°C ~ 125°C; Applications: General Purpose; Ratings: -; Package / Case: 0603 (1608 Metric); Size / Dimension: 0.063" L x 0.031" W (1.60mm x 0.80mm); Height - Seated (Max): -; Thickness (Max): 0.035" (0.90mm); Lead Spacing: -; Features: -; Lead Style: -; ComponentLink1URL: http://search.murata.co.jp/Ceramy/image/img/A01X/G101/ENG/GRM188R71C104KA01-01.pdf; ComponentLink1Description: http://search.murata.co.jp/Ceramy/image/img/A01X/G101/ENG/GRM188R71C104KA01-01.pdf
C75 C79 C80 = GRM1885C1H102JA01D: CAP CER 1000PF 50V 5% NP0 0603; Manufacturer: Murata Electronics North America; Temperature Coefficient: C0G, NP0; Supplier 1: Digi-Key; Manufacturer Part Number: GRM1885C1H102JA01D; RoHS: RoHS Compliant; Category: Capacitors; Stock 1: 140000; Pricing 1: 4000=0.00863, 8000=0.00788, 12000=0.0075, 28000=0.00713, 100000=0.00516 (USD); Packaging: Tape & Reel (TR); Capacitance: 1000pF; Voltage - Rated: 50V; Tolerance: ±5%; Mounting Type: Surface Mount, MLCC; Operating Temperature: -55°C ~ 125°C; Applications: General Purpose; Ratings: -; Package / Case: 0603 (1608 Metric); Size / Dimension: 0.063" L x 0.031" W (1.60mm x 0.80mm); Height - Seated (Max): -; Thickness (Max): 0.035" (0.90mm); Lead Spacing: -; Features: -; Lead Style: -; ComponentLink1URL: http://www.murata.com/products/catalog/pdf/c02e.pdf; ComponentLink1Description: http://www.murata.com/products/catalog/pdf/c02e.pdf
C85 = GRM188R71C103KA01D: CAP CER 10000PF 16V 10% X7R 0603; Manufacturer: Murata Electronics North America; Supplier 1: Digi-Key; Manufacturer Part Number: GRM188R71C103KA01D; RoHS: RoHS Compliant; Category: Capacitors; Stock 1: 0; Pricing 1: 1=0 (USD); Packaging: Cut Tape (CT); Capacitance: 10000pF; Voltage - Rated: 16V; Tolerance: ±10%; Temperature Coefficient: X7R; Mounting Type: Surface Mount, MLCC; Operating Temperature: -55°C ~ 125°C; Applications: General Purpose; Ratings: -; Package / Case: 0603 (1608 Metric); Size / Dimension: 0.063" L x 0.031" W (1.60mm x 0.80mm); Height - Seated (Max): -; Thickness (Max): 0.035" (0.90mm); Lead Spacing: -; Features: -; Lead Style: -; ComponentLink1URL: http://search.murata.co.jp/Ceramy/image/img/A01X/G101/ENG/GRM188R71C103KA01-01.pdf; ComponentLink1Description: http://search.murata.co.jp/Ceramy/image/img/A01X/G101/ENG/GRM188R71C103KA01-01.pdf
FB8 = BLM18BD221SN1D: FERRITE CHIP 220 OHM 200MA 0603; Manufacturer: Murata Electronics North America; Impedance @ Frequency: 220 Ohm @ 100MHz; DC Resistance (DCR): 450 mOhm Max; Filter Type: Differential Mode - Single; Supplier 1: Digi-Key; Manufacturer Part Number: BLM18BD221SN1D; RoHS: RoHS Compliant; Category: Filters; Stock 1: 35645; Pricing 1: 1=0.1, 10=0.087, 50=0.0712, 100=0.0523, 250=0.038, 500=0.03484, 1000=0.0301 (USD); Packaging: Cut Tape (CT); Current Rating: 200mA; Package / Case: 0603 (1608 Metric); Mounting Type: Surface Mount; Height (Max): 0.037" (0.95mm); Size / Dimension: 0.063" L x 0.031" W (1.60mm x 0.80mm); ComponentLink1URL: http://search.murata.co.jp/Ceramy/image/img/PDF/ENG/L0110S0100BLM18B.pdf; ComponentLink1Description: http://search.murata.co.jp/Ceramy/image/img/PDF/ENG/L0110S0100BLM18B.pdf
FL1 = NFM21CC223R1H3D: FILTER LC HIGH FREQ 22000PF 0805; Manufacturer: Murata Electronics North America; Capacitance: 0.022µF; Voltage: 50V; Current: 2A; DC Resistance (DCR): 30 mOhm Max; Supplier 1: Digi-Key; Manufacturer Part Number: NFM21CC223R1H3D; RoHS: RoHS Compliant; Category: Filters; Stock 1: 4000; Pricing 1: 4000=0.12353, 8000=0.11438 (USD); Packaging: Tape & Reel (TR); Operating Temperature: -55°C ~ 125°C; Package / Case: 0805 (2012 Metric), 3 PC Pad; Height (Max): 0.037" (0.95mm); Size / Dimension: 0.079" L x 0.049" W (2.00mm x 1.25mm); Thread Size: -; ComponentLink1URL: http://search.murata.co.jp/Ceramy/image/img/PDF/ENG/L0111S0109NFM21C.pdf; ComponentLink1Description: http://search.murata.co.jp/Ceramy/image/img/PDF/ENG/L0111S0109NFM21C.pdf
J3 = 5004: TEST POINT PC MINI .040"D YELLOW; Manufacturer: Keystone Electronics; Supplier 1: Digi-Key; Manufacturer Part Number: 5004; RoHS: RoHS Compliant; Category: Test and Measurement; Stock 1: 45761; Pricing 1: 1=0.34, 10=0.318, 50=0.232, 100=0.2228, 250=0.20008, 500=0.191, 1000=0.15916, 2500=0.14552, 5000=0.13643 (USD); Packaging: Bulk; Type: PC Test Point, Miniature; Terminal: 0.010" x 0.020" (0.25mm x 0.51mm) Phosphor Bronze Wire, Silver Plated; Mounting Type: 0.040" (1.02mm) Hole Diameter; Material: Base, Nylon 46, UL 94V-0; Color: Yellow; ComponentLink1URL: http://www.keyelco.com/product-pdf.cfm?p=1313; ComponentLink1Description: http://www.keyelco.com/product-pdf.cfm?p=1313
L10 = LQM18FN100M00D: INDUCTOR 10UH 50MA 0603; Manufacturer: Murata Electronics North America; Type: Multilayer; Inductance: 10µH; Tolerance: ±20%; Shielding: Shielded; DC Resistance (DCR): 900 mOhm; Frequency - Self Resonant: 30MHz; Frequency - Test: 1MHz; Supplier 1: Digi-Key; Manufacturer Part Number: LQM18FN100M00D; RoHS: RoHS Compliant; Category: Inductors, Coils, Chokes; Stock 1: 28547; Pricing 1: 1=0.14, 10=0.13, 25=0.1164, 50=0.101, 100=0.0907, 250=0.08416, 500=0.0777, 750=0.07381, 1000=0.06734 (USD); Packaging: Cut Tape (CT); Material - Core: -; Current Rating: 50mA; Current - Saturation: -; Q @ Freq: -; Operating Temperature: -55°C ~ 125°C; Mounting Type: Surface Mount; Package / Case: 0603 (1608 Metric); Size / Dimension: 0.063" L x 0.031" W (1.60mm x 0.80mm); Height - Seated (Max): 0.035" (0.90mm); Supplier Device Package: 0603 (1608 Metric); ComponentLink1URL: http://search.murata.co.jp/Ceramy/image/img/PDF/ENG/L0075S0097LQM18F.pdf; ComponentLink1Description: http://search.murata.co.jp/Ceramy/image/img/PDF/ENG/L0075S0097LQM18F.pdf
R7 = MCR03ERTF1002: RES SMD 10K OHM 1% 1/10W 0603; Manufacturer: Rohm Semiconductor; Power (Watts): 0.1W, 1/10W; Temperature Coefficient: ±100ppm/°C; Supplier 1: Digi-Key; Manufacturer Part Number: MCR03ERTF1002; RoHS: RoHS Compliant; Category: Resistors; Stock 1: 30590; Pricing 1: 1=0.1, 10=0.022, 25=0.016, 100=0.0089, 250=0.0068, 500=0.00542, 1000=0.00399 (USD); Packaging: Digi-Reel®; Resistance (Ohms): 10k; Tolerance: ±1%; Composition: Thick Film; Features: -; Package / Case: 0603 (1608 Metric); Supplier Device Package: 0603 (1608 Metric); Size / Dimension: 0.063" L x 0.031" W (1.60mm x 0.80mm); Height: 0.022" (0.55mm); Number of Terminations: 2; ComponentLink1URL: http://rohmfs.rohm.com/en/products/databook/datasheet/passive/resistor/chip_resistor/mcr_g.pdf; ComponentLink1Description: http://rohmfs.rohm.com/en/products/databook/datasheet/passive/resistor/chip_resistor/mcr_g.pdf; Operating Temperature: -55°C ~ 155°C; Supplier Part Number 1: RHM10.0KCFDKR-ND
R8 = RC0603FR-071ML: RES 1.00M OHM 1/10W 1% 0603 SMD; Manufacturer: Yageo; Resistance (Ohms): 1M; Power (Watts): 0.1W, 1/10W; Temperature Coefficient: ±100ppm/°C; Supplier 1: Digi-Key; Manufacturer Part Number: RC0603FR-071ML; RoHS: RoHS Compliant; Category: Resistors; Stock 1: 1280000; Pricing 1: 5000=0.00171, 10000=0.00149, 25000=0.00131, 50000=0.0012, 125000=0.00117 (USD); Packaging: Tape & Reel (TR); Tolerance: ±1%; Composition: Thick Film; Features: -; Package / Case: 0603 (1608 Metric); Supplier Device Package: 0603; Size / Dimension: 0.063" L x 0.031" W (1.60mm x 0.80mm); Height: 0.022" (0.55mm); Number of Terminations: 2; ComponentLink1URL: http://www.yageo.com/documents/recent/PYu-RC0603_51_RoHS_L_4.pdf; ComponentLink1Description: http://www.yageo.com/documents/recent/PYu-RC0603_51_RoHS_L_4.pdf
R9 R11 = RC0603FR-07100KL: RES 100K OHM 1/10W 1% 0603 SMD; Manufacturer: Yageo; Power (Watts): 0.1W, 1/10W; Temperature Coefficient: ±100ppm/°C; Supplier 1: Digi-Key; Manufacturer Part Number: RC0603FR-07100KL; RoHS: RoHS Compliant; Category: Resistors; Stock 1: 2865000; Pricing 1: 5000=0.00171, 10000=0.00149, 25000=0.00131, 50000=0.0012, 125000=0.00117 (USD); Packaging: Tape & Reel (TR); Resistance (Ohms): 100k; Tolerance: ±1%; Composition: Thick Film; Features: -; Package / Case: 0603 (1608 Metric); Supplier Device Package: 0603; Size / Dimension: 0.063" L x 0.031" W (1.60mm x 0.80mm); Height: 0.022" (0.55mm); Number of Terminations: 2; ComponentLink1URL: http://www.yageo.com/documents/recent/PYu-RC0603_51_RoHS_L_4.pdf; ComponentLink1Description: http://www.yageo.com/documents/recent/PYu-RC0603_51_RoHS_L_4.pdf
R10 = CRCW06031K00FKEA: RES SMD 1K OHM 1% 1/10W 0603; Manufacturer: Vishay Dale; Power (Watts): 0.1W, 1/10W; Temperature Coefficient: ±100ppm/°C; Supplier 1: Digi-Key; Manufacturer Part Number: CRCW06031K00FKEA; RoHS: RoHS Compliant; Category: Resistors; Stock 1: 1035099; Pricing 1: 10=0.081, 50=0.0436, 200=0.0251, 1000=0.01711 (USD); Packaging: Digi-Reel®; Resistance (Ohms): 1k; Tolerance: ±1%; Composition: Thick Film; Features: Automotive AEC-Q200; Package / Case: 0603 (1608 Metric); Supplier Device Package: 0603 (1608 Metric); Size / Dimension: 0.061" L x 0.033" W (1.55mm x 0.85mm); Height: 0.020" (0.50mm); Number of Terminations: 2; ComponentLink1URL: http://www.vishay.com/docs/20035/dcrcwe3.pdf; ComponentLink1Description: http://www.vishay.com/docs/20035/dcrcwe3.pdf; Operating Temperature: -55°C ~ 155°C; Supplier Part Number 1: 541-1.00KHDKR-ND
U4 = FAN2500S30X: IC REG LDO 3V 0.1A SOT23-5; Manufacturer: Fairchild Semiconductor; Regulator Topology: Positive Fixed; Current - Output: 100mA; Voltage - Dropout (Typical): 0.1V @ 100mA; Number of Regulators: 1; Voltage - Input: Up to 6.5V; Supplier 1: Digi-Key; Manufacturer Part Number: FAN2500S30X; RoHS: RoHS Compliant; Category: Integrated Circuits (ICs); Stock 1: 6000; Pricing 1: 3000=0.25462, 6000=0.23706, 15000=0.22828, 30000=0.2195, 75000=0.21599, 150000=0.21072 (USD); Packaging: Tape & Reel (TR); Voltage - Output: 3V; Current - Limit (Min): -; Operating Temperature: -40°C ~ 125°C; Mounting Type: Surface Mount; Package / Case: SC-74A, SOT-753; Supplier Device Package: SOT-23-5; ComponentLink1URL: http://www.fairchildsemi.com/ds/FA/FAN2500.pdf; ComponentLink1Description: http://www.fairchildsemi.com/ds/FA/FAN2500.pdf
U5 U6 = NC7SPU04P5X: IC INVERTER ULP UNBUFF SC70-5; Manufacturer: Fairchild Semiconductor; Number of Circuits: 1; Voltage - Supply: 0.9 V ~ 3.6 V; Current - Quiescent (Max): 0.9µA; Current - Output High, Low: 2.6mA, 2.6mA; Max Propagation Delay @ V, Max CL: 9.2ns @ 3.3V, 30pF; Supplier 1: Digi-Key; Manufacturer Part Number: NC7SPU04P5X; RoHS: RoHS Compliant; Category: Integrated Circuits (ICs); Stock 1: 24000; Pricing 1: 3000=0.0798, 6000=0.07182, 15000=0.06384, 30000=0.05985, 75000=0.05307, 150000=0.05107 (USD); Packaging: Tape & Reel (TR); Logic Type: Inverter; Number of Inputs: 1; Features: -; Logic Level - Low: -; Logic Level - High: -; Operating Temperature: -40°C ~ 85°C; Mounting Type: Surface Mount; Supplier Device Package: SC-70-5; Package / Case: 6-TSSOP (5 Lead), SC-88A, SOT-353; ComponentLink1URL: http://www.fairchildsemi.com/ds/NC/NC7SPU04.pdf; ComponentLink1Description: http://www.fairchildsemi.com/ds/NC/NC7SPU04.pdf
U7 = MCP4922-E/ST: IC DAC 12BIT DUAL W/SPI 14TSSOP; Manufacturer: Microchip Technology; Settling Time: 4.5µs; Number of Bits: 12; Data Interface: Serial, SPI™; Number of Converters: 2; Voltage Supply Source: Single Supply; Number of Outputs and Type: 2 Voltage, Unipolar; 2 Voltage, Bipolar; Supplier 1: Digi-Key; Manufacturer Part Number: MCP4922-E/ST; RoHS: RoHS Compliant; Category: Integrated Circuits (ICs); Stock 1: 461; Pricing 1: 1=3.14, 10=2.62, 25=2.19, 100=1.99 (USD); Packaging: Tube; Operating Temperature: -40°C ~ 125°C; Mounting Type: Surface Mount; Package / Case: 14-TSSOP (0.173", 4.40mm Width); Supplier Device Package: 14-TSSOP; Sampling Rate (Per Second): *; ComponentLink1URL: http://www.microchip.com/mymicrochip/filehandler.aspx?ddocname=en547858; ComponentLink1Description: http://www.microchip.com/mymicrochip/filehandler.aspx?ddocname=en547858
X1 = ASVTX-12-A-40.000MHZ-H10-T: OSC VCTCXO 40.000MHZ SNWV SMD; Manufacturer: Abracon Corporation; Frequency: 40MHz; Output: Clipped Sine Wave; Voltage - Supply: 3V; Frequency Stability: ±1ppm; Current - Supply (Max): 2.5mA; Supplier 1: Digi-Key; Manufacturer Part Number: ASVTX-12-A-40.000MHZ-H10-T; RoHS: RoHS Compliant; Category: Crystals and Oscillators; Stock 1: 0; Pricing 1: 1000=2.17, 3000=2.015, 5000=1.9375 (USD); Packaging: Tape & Reel (TR); Type: VCTCXO; Function: -; Operating Temperature: -30°C ~ 85°C; Ratings: -; Mounting Type: Surface Mount; Size / Dimension: 0.098" L x 0.079" W (2.50mm x 2.00mm); Height: 0.035" (0.90mm); Package / Case: 4-SMD, No Lead (DFN, LCC); Current - Supply (Disable) (Max): -; ComponentLink1URL: http://www.abracon.com/Oscillators/ASTX12_ASVTX12.pdf; ComponentLink1Description: http://www.abracon.com/Oscillators/ASTX12_ASVTX12.pdf

## Nets that join several sheets
3V3: DW1000 (26 pins), Dawn (6 pins), HFXO (8 pins)
GND: DW1000 (45 pins), Dawn (6 pins), HFXO (19 pins)
ANT: DW1000 (B1.1), Dawn (A2.1)
~{CS}: Dawn (P3.2), HFXO (U7.3)
CLK: DW1000 (U2.3), Dawn (P2.1), HFXO (U6.4)
GPIO0_R: DW1000 (U2.38), Dawn (R15.2)
GPIO1_R: DW1000 (U2.37), Dawn (R14.2)
GPIO2_R: DW1000 (U2.36), Dawn (R13.2)
GPIO4_R: DW1000 (U2.34), Dawn (R12.2)
RESET: DW1000 (U2.27), Dawn (RJ1.2)
SCLK: DW1000 (U2.41), Dawn (P2.3), HFXO (U7.4)
SDI: DW1000 (U2.39), Dawn (P2.2), HFXO (U7.5)
SPI_CS_EX: DW1000 (U2.24), Dawn (P2.7)
SPI_MISO: DW1000 (U2.40), Dawn (P2.6)